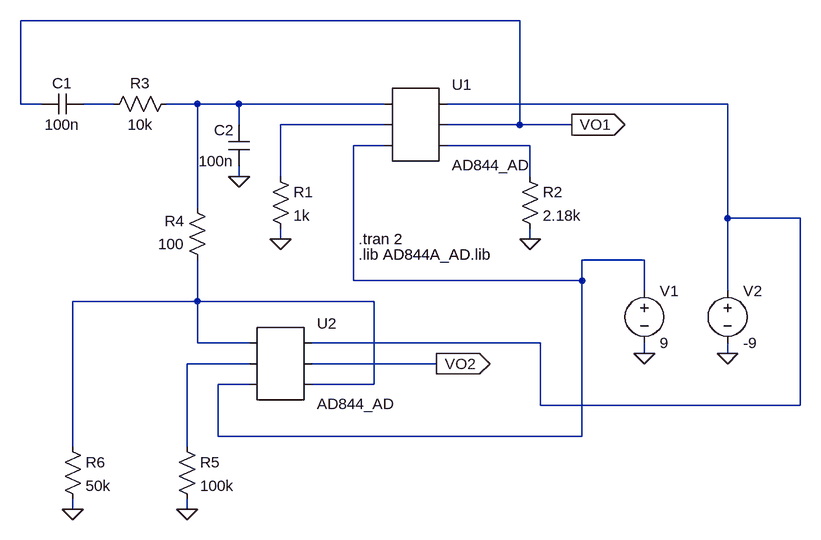
[diagram p0: schematic hopefully_sinosiodal_but_not_really.asc]
hopefully_sinosiodal_but_not_really.asc, the LTspice schematic file:
Version 4
SHEET 1 1012 852
WIRE 576 80 -192 80
WIRE -192 208 -192 80
WIRE -160 208 -192 208
WIRE -48 208 -96 208
WIRE 80 208 32 208
WIRE 144 208 80 208
WIRE 368 208 144 208
WIRE 896 208 464 208
WIRE 144 240 144 208
WIRE 368 240 208 240
WIRE 576 240 576 80
WIRE 576 240 464 240
WIRE 656 240 576 240
WIRE 368 272 320 272
WIRE 592 272 464 272
WIRE 144 320 144 304
WIRE 208 320 208 240
WIRE 592 320 592 272
WIRE 80 368 80 208
WIRE 896 384 896 208
WIRE 1008 384 896 384
WIRE 208 416 208 400
WIRE 592 416 592 400
WIRE 768 448 672 448
WIRE 320 480 320 272
WIRE 672 480 672 448
WIRE 672 480 320 480
WIRE 768 496 768 448
WIRE 896 496 896 384
WIRE 80 512 80 448
WIRE 80 512 -112 512
WIRE 352 512 80 512
WIRE 80 576 80 512
WIRE 160 576 80 576
WIRE 608 576 256 576
WIRE 768 592 768 576
WIRE 896 592 896 576
WIRE 160 608 64 608
WIRE 448 608 256 608
WIRE 160 640 112 640
WIRE 352 640 352 512
WIRE 352 640 256 640
WIRE 608 672 608 576
WIRE 1008 672 1008 384
WIRE 1008 672 608 672
WIRE 112 720 112 640
WIRE 672 720 672 480
WIRE 672 720 112 720
WIRE -112 736 -112 512
WIRE 64 736 64 608
WIRE -112 832 -112 816
WIRE 64 832 64 816
FLAG 144 320 0
FLAG 208 416 0
FLAG 592 416 0
FLAG -112 832 0
FLAG 64 832 0
FLAG 656 240 VO1
IOPIN 656 240 Out
FLAG 448 608 VO2
IOPIN 448 608 Out
FLAG 768 592 0
FLAG 896 592 0
SYMBOL res 192 304 R0
SYMATTR InstName R1
SYMATTR Value 1k
SYMBOL res 576 304 R0
SYMATTR InstName R2
SYMATTR Value 2.18k
SYMBOL res 48 192 R90
WINDOW 0 0 56 VBottom 2
WINDOW 3 32 56 VTop 2
SYMATTR InstName R3
SYMATTR Value 10k
SYMBOL res 96 464 R180
WINDOW 0 36 76 Left 2
WINDOW 3 36 40 Left 2
SYMATTR InstName R4
SYMATTR Value 100
SYMBOL cap -96 192 R90
WINDOW 0 0 32 VBottom 2
WINDOW 3 32 32 VTop 2
SYMATTR InstName C1
SYMATTR Value 100n
SYMBOL cap 160 304 R180
WINDOW 0 24 56 Left 2
WINDOW 3 24 8 Left 2
SYMATTR InstName C2
SYMATTR Value 100n
SYMBOL res 48 720 R0
SYMATTR InstName R5
SYMATTR Value 100k
SYMBOL res -128 720 R0
SYMATTR InstName R6
SYMATTR Value 50k
SYMBOL voltage 768 480 R0
SYMATTR InstName V1
SYMATTR Value 9
SYMBOL voltage 896 480 R0
SYMATTR InstName V2
SYMATTR Value -9
SYMBOL AutoGenerated/AD844_AD 416 240 R0
SYMATTR InstName U1
SYMBOL AutoGenerated/AD844_AD 208 608 R0
SYMATTR InstName U2
TEXT 328 416 Left 2 !.tran 2
TEXT 328 440 Left 2 !.lib AD844A_AD.lib

The netlist it stands for:
* hopefully_sinosiodal_but_not_really.asc
R1 N004 0 1k
R2 N006 0 2.18k
R3 N002 N001 10k
R4 N007 N002 100
C1 N001 VO1 100n
C2 0 N002 100n
R5 N008 0 100k
R6 N007 0 50k
V1 N005 0 9
V2 N003 0 -9
* U1: AD844_AD (symbol AutoGenerated/AD844_AD not available, pins judged from their places): pin1=N002 pin2=N004 pin3=N005 pin4=N003 pin5=VO1 pin6=N006
* U2: AD844_AD (symbol AutoGenerated/AD844_AD not available, pins judged from their places): pin1=N007 pin2=N008 pin3=N005 pin4=N003 pin5=VO2 pin6=N007
.tran 2
.lib AD844A_AD.lib
.backanno
.end